# EasyEDA Pro project ProPrj_机器人系列_通用扩展模块.epro

# Schematic Schematic12
Board Name: 四合一底板; Create Date: 2025-06-17; Page Name: P1; Project Name: 机器人系列_通用扩展模块; Schematic Name: Schematic12; Update Date: 2025-07-04
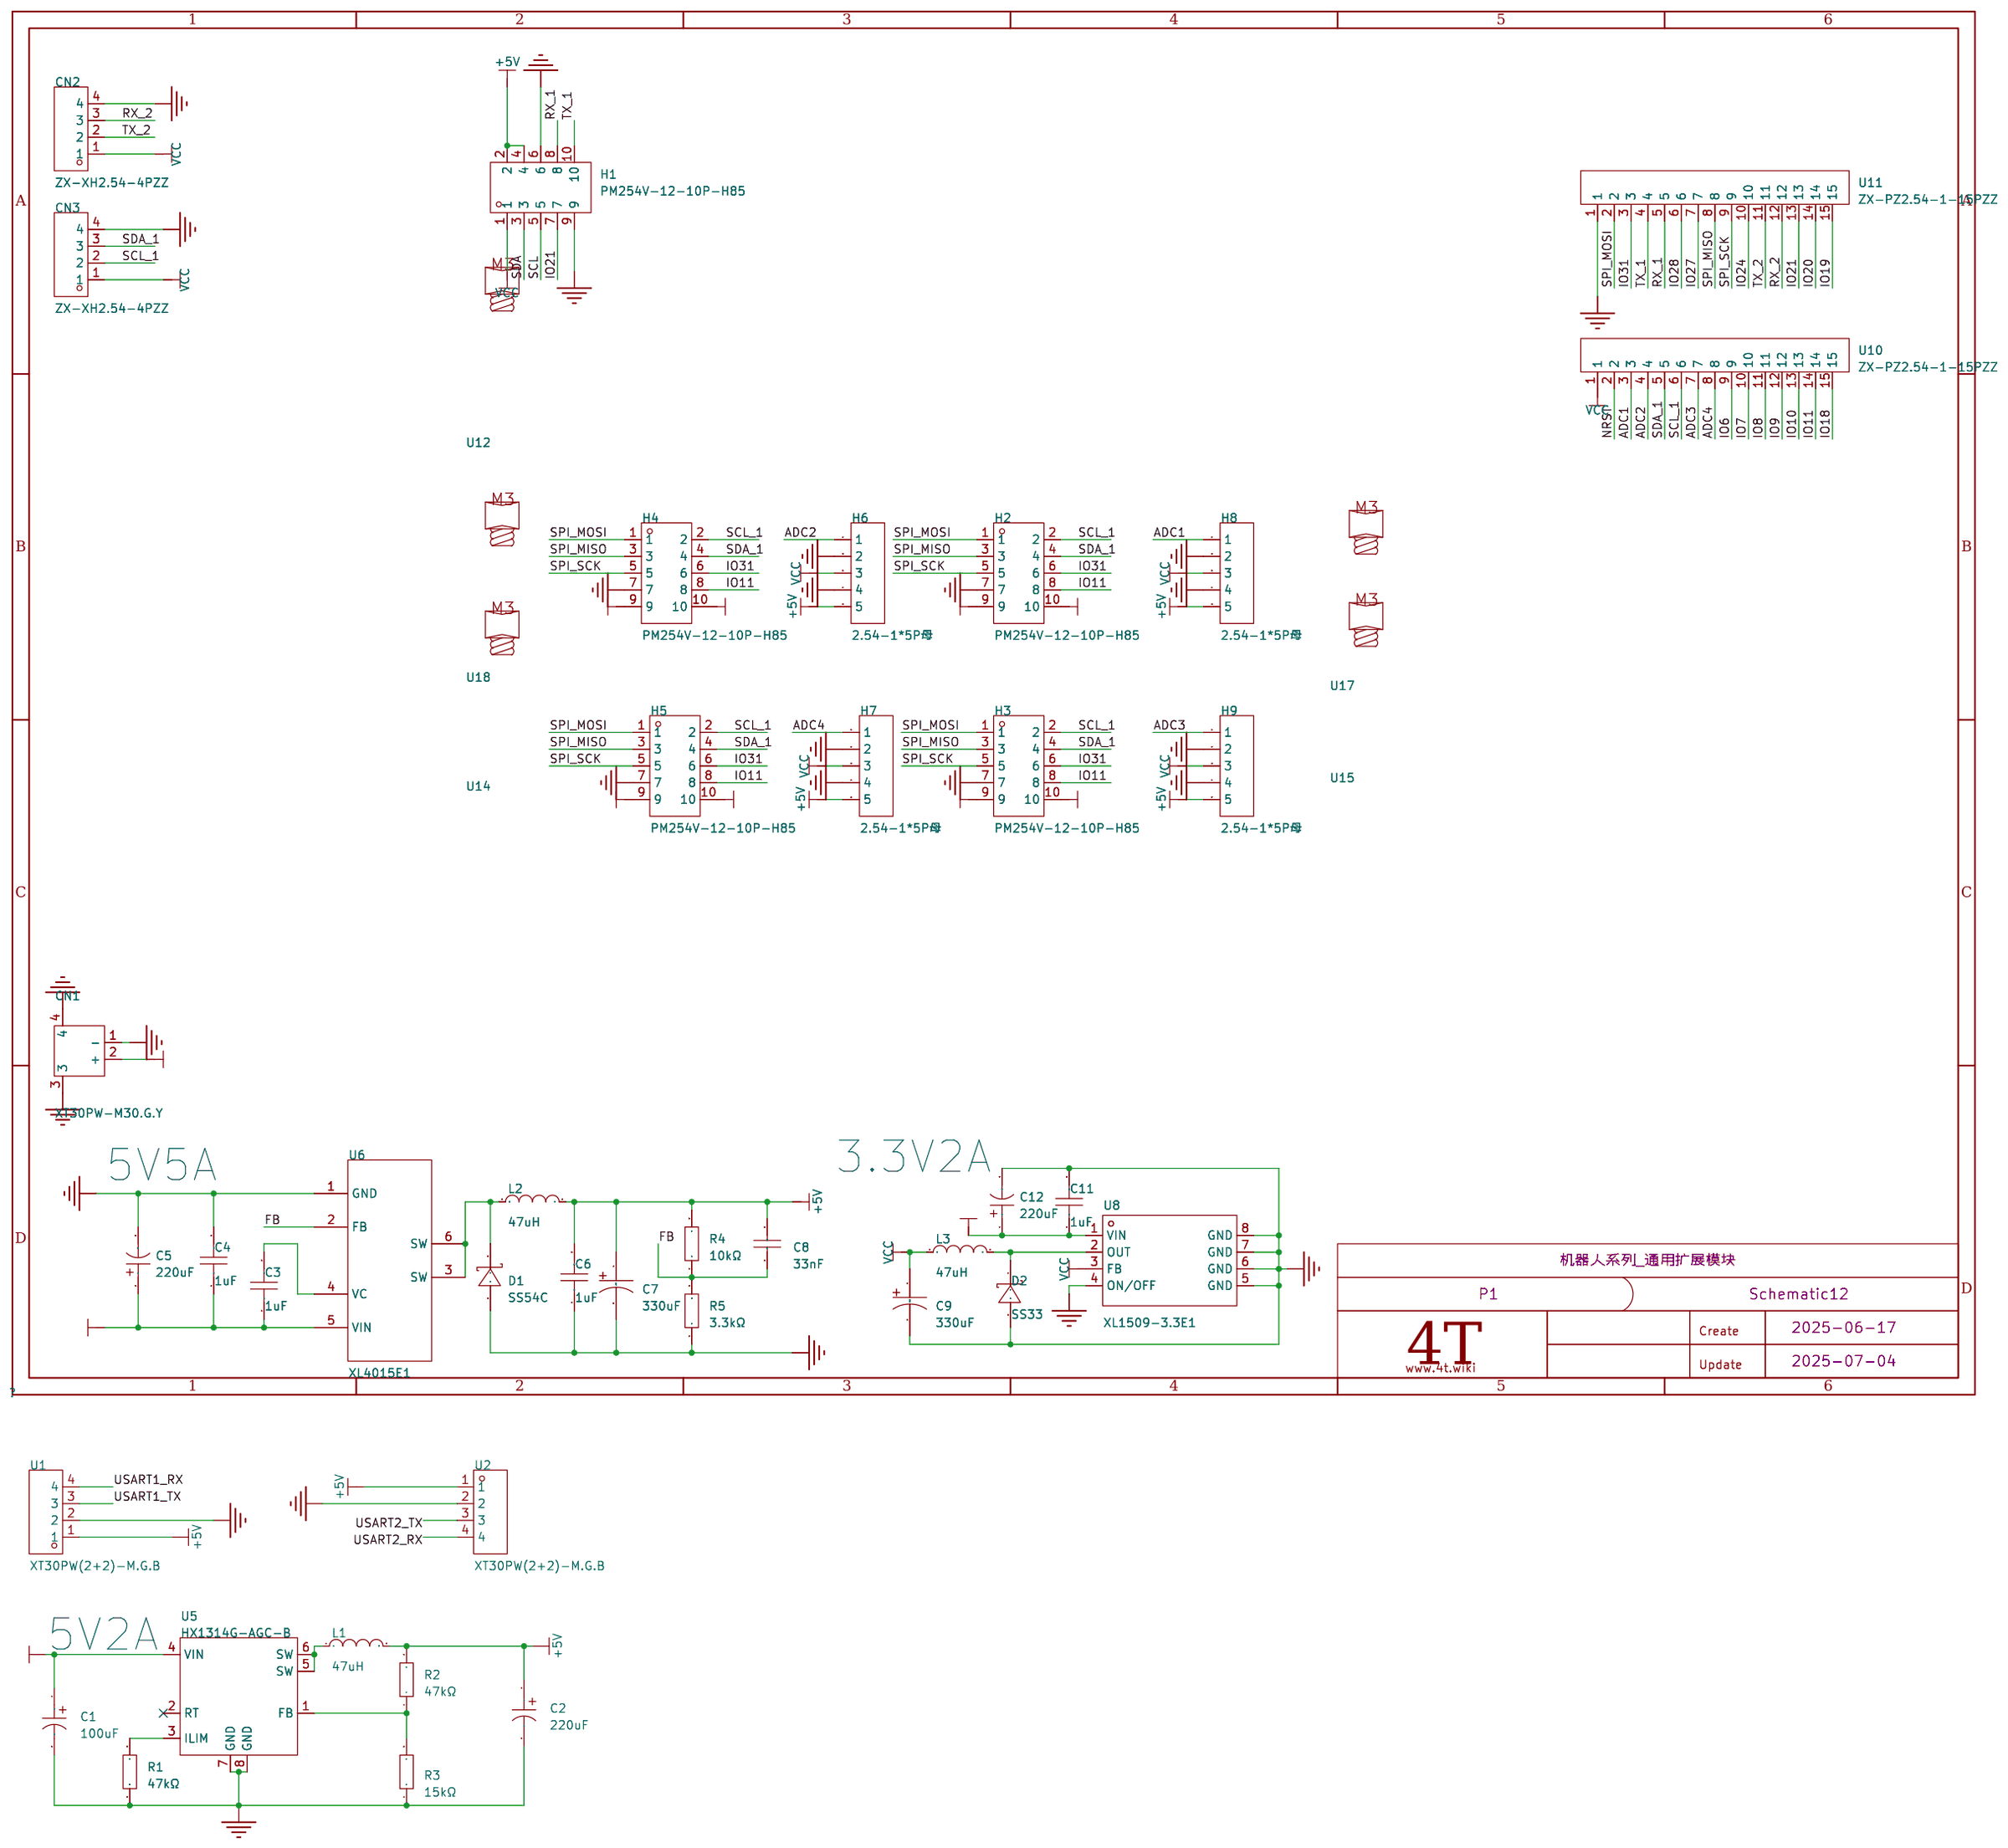
[diagram p0: schematic sheet]

## Parts
C1  100uF  [CAP-SMD_BD6.3-L6.6-W6.6-LS7.4-FD]  (no BOM)
C2  220uF  [CAP-SMD_BD6.3-L6.6-W6.6-FD]  (no BOM)
C3  1uF  [C0402]
C4  1uF  [C0402]
C5  220uF  [CAP-SMD_BD6.3-L6.6-W6.6-LS7.4-FD]
C6  1uF  [C0402]
C7  330uF  [CAP-SMD_BD8.0-L8.3-W8.3-LS9.3-FD-1]
C8  33nF  [C0603]
C9  330uF  [CAP-SMD_BD8.0-L8.3-W8.3-LS9.3-FD-1]
C11  1uF  [C0402]
C12  220uF  [CAP-SMD_BD6.3-L6.6-W6.6-LS7.4-FD]
CN1  XT30PW-M30.G.Y  [CONN-TH_XT30PW-M]
CN2  ZX-XH2.54-4PZZ  [CONN-TH_4P-P2.50_4PIN]
CN3  ZX-XH2.54-4PZZ  [CONN-TH_4P-P2.50_4PIN]
D1  SS54C  [SMC_L7.1-W6.2-LS8.1-R-RD]
D2  SS33  [SMA_L4.3-W2.6-LS5.1-RD]
H1  PM254V-12-10P-H85  [HDR-TH_10P-P2.54-V-F-R2-C5-S2.54]
H2  PM254V-12-10P-H85  [HDR-TH_10P-P2.54-V-F-R2-C5-S2.54]
H3  PM254V-12-10P-H85  [HDR-TH_10P-P2.54-V-F-R2-C5-S2.54]
H4  PM254V-12-10P-H85  [HDR-TH_10P-P2.54-V-F-R2-C5-S2.54]
H5  PM254V-12-10P-H85  [HDR-TH_10P-P2.54-V-F-R2-C5-S2.54]
H6  2.54-1*5P母  [HDR-TH_5P-P2.54-V-F]
H7  2.54-1*5P母  [HDR-TH_5P-P2.54-V-F]
H8  2.54-1*5P母  [HDR-TH_5P-P2.54-V-F]
H9  2.54-1*5P母  [HDR-TH_5P-P2.54-V-F]
L1  47uH  [IND-SMD_L7.3-W6.8]  (no BOM)
L2  47uH  [IND-SMD_L13.8-W12.6_H6.5]
L3  47uH  [IND-SMD_L7.3-W6.8]
R1  47kΩ  [R0603]  (no BOM)
R2  47kΩ  [R0603]  (no BOM)
R3  15kΩ  [R0603]  (no BOM)
R4  10kΩ  [R0603]
R5  3.3kΩ  [R0603]
U1  XT30PW(2+2)-M.G.B  [CONN-TH_4P-XT30PW-M]  (no BOM)
U2  XT30PW(2+2)-M.G.B  [CONN-TH_4P-XT30PW-M]  (no BOM)
U5  HX1314G-AGC-B  [SOP-8_L4.9-W3.9-P1.27-LS6.0-BL]  (no BOM)
U6  XL4015E1  [TO-263-5_L10.2-W8.9-P1.70-TL]
U8  XL1509-3.3E1  [SOP-8_L4.9-W3.9-P1.27-LS6.0-BL]
U10  ZX-PZ2.54-1-15PZZ  [HDR-TH_15P-P2.54-V-M]
U11  ZX-PZ2.54-1-15PZZ  [HDR-TH_15P-P2.54-V-M]
U12  -  [M3]
U14  -  [M3]
U15  -  [M3]
U17  -  [M3]
U18  -  [M3]

## Library data of the parts
C1 = RVT100UF35V67RV0034: 容值:100uF;精度:±20%;额定电压:35V;纹波电流:87mA@120kHz;等效串联电阻:-;; LCSC Part Name: 100uF ±20% 35V; Supplier Part: C2836442; Manufacturer: KNSCHA(科尼盛); Supplier Footprint: SMD,D6.3xL7.7mm; JLCPCB Part Class: 扩展库; Datasheet: https://atta.szlcsc.com/upload/public/pdf/source/20210528/C2836442_7F6389BF36F63F32D6DF3A507E8E95D6.pdf; Supplier: LCSC; Tolerance: ±20%; Rated Voltage: 35V; Ripple Current: 87mA@120kHz; φD: 6.3mm; L: 7.7mm; Lifetime @ Temp: 2000hrs@105℃; Operating Temperature: -55℃~+105℃
C2 = RVT220UF16V67RV0015: 容值:220uF;精度:±20%;额定电压:16V;纹波电流:110mA@120Hz;等效串联电阻:-;; LCSC Part Name: 220uF ±20% 16V; Supplier Part: C2887273; Manufacturer: KNSCHA(科尼盛); Supplier Footprint: SMD,D6.3xL7.7mm; JLCPCB Part Class: 扩展库; Datasheet: https://atta.szlcsc.com/upload/public/pdf/source/20210824/3DC9999D9B098FE241E3A26137981C4C.pdf; Supplier: LCSC; Tolerance: ±20%; Rated Voltage: 16V; Ripple Current: 110mA@120Hz; φD: 6.3mm; L: 7.7mm; Lifetime @ Temp: 2000hrs@105℃; Operating Temperature: -55℃~+105℃
C3 C4 C6 C11 = CL05A105KA5NQNC: 容值:1uF;精度:±10%;额定电压:25V;材质(温度系数):X5R;; LCSC Part Name: 1uF ±10% 25V; Supplier Part: C52923; Manufacturer: SAMSUNG(三星); Supplier Footprint: 0402; JLCPCB Part Class: 基础库; Datasheet: https://atta.szlcsc.com/upload/public/pdf/source/20160218/1457707763339.pdf; Supplier: LCSC; Tolerance: ±10%; Voltage Rated: 25V; Temperature Coefficient: X5R
C5 C12 = RVT1E221M0607: 容值:220uF;精度:±20%;额定电压:25V;纹波电流:150mA@120Hz;等效串联电阻(ESR):-;; LCSC Part Name: 220uF ±20% 25V; Supplier Part: C2918361; Manufacturer: ROQANG(容强); Supplier Footprint: SMD,D6.3xL7.7mm; JLCPCB Part Class: 扩展库; Datasheet: https://atta.szlcsc.com/upload/public/pdf/source/20241024/87413EF5140CF44BEEEC408A2EAB4036.pdf; Supplier: LCSC; Tolerance: ±20%; Voltage Rating: 25V; Ripple Current: 150mA@120Hz; Diameter: 6.3mm; Height - Seated (Max): 7.7mm; Lifetime: 2000hrs@105℃; Operating Temperature: -40℃~+105℃
C7 C9 = RVT1E331M0810_C335985: 容值:330uF;精度:±20%;额定电压:25V;纹波电流:228mA@120Hz;等效串联电阻(ESR):-;; LCSC Part Name: 330uF ±20% 25V; Supplier Part: C335985; Manufacturer: ROQANG(容强); Manufacturer Part: RVT1E331M0810; Supplier Footprint: SMD,D8xL10.2mm; JLCPCB Part Class: Extended Part; Datasheet: https://atta.szlcsc.com/upload/public/pdf/source/20181128/C335987_23CA7AA50FB42690DF736C43FE112376.pdf; Supplier: LCSC; Tolerance: ±20%; Voltage Rating: 25V; Ripple Current: 228mA@120Hz; Diameter: 8mm; Height - Seated (Max): 10.2mm; Lifetime: 2000hrs@105℃; Operating Temperature: -40℃~+105℃
C8 = CL10B333KB8NNNC: 容值:33nF;精度:±10%;额定电压:50V;材质(温度系数):X7R;; LCSC Part Name: 33nF ±10% 50V; Supplier Part: C21117; Manufacturer: SAMSUNG(三星); Supplier Footprint: 0603; JLCPCB Part Class: 基础库; Datasheet: https://atta.szlcsc.com/upload/public/pdf/source/20160218/1457707763339.pdf; Supplier: LCSC; Tolerance: ±10%; Voltage Rated: 50V; Temperature Coefficient: X7R
CN1 = XT30PW-M30.G.Y: 类别:-;类型1:-;; LCSC Part Name: AMASS(艾迈斯)航模插头 卧式弯脚 XT30PW-M公头; Supplier Part: C431092; Manufacturer: AMASS(艾迈斯); JLCPCB Part Class: 扩展库; Datasheet: https://atta.szlcsc.com/upload/public/pdf/source/20220222/6A9F22F7850E25B33E1BE430ADF8560B.pdf; Supplier: LCSC; Type: 航模插头; RatedVoltage: DC 500V; InterfaceType: 公头; RatedCurrent: 15A; RecommendedWireGauge: 16/18/20AWG; contact resistance: 1.2mΩ; specifications: 2pin
CN2 CN3 = ZX-XH2.54-4PZZ: 插针结构:1x4P;间距:2.5mm;安装方式:直插;参考系列:XH;总PIN数:4P;排数:1;每排PIN数:4;行距:-;额定电流:3A;触头材质:黄铜;触头镀层:锡;工作温度范围:-25℃~+85℃;; LCSC Part Name: 1x4P 间距:2.5mm 直插 系列:XH; Supplier Part: C7429634; Manufacturer: Megastar(兆星); Supplier Footprint: 插件,P=2.5mm; JLCPCB Part Class: 扩展库; Datasheet: https://atta.szlcsc.com/upload/public/pdf/source/20230619/B529A2163E0159A644AB3383D208FB03.pdf; Supplier: LCSC; Pins Structure: 1x4P; Pitch: 2.5mm; Mounting Type: 直插; Reference Series: XH; Number of Pins: 4P; Number of Rows: 1; Number of PINs Per Row: 4; Rated Current: 3A; Contact Material: 黄铜; Contact Plating: 锡; Operating Temperature: -25℃~+85℃; Rated Voltage (Max): 250V; Plastic Material: PA66; Flame Retardant Rating: UL94V-0; Color: 白色; Z-Height of the Board: 7mm; X-Length of Bottom Edge on Board (Spacing Line): 12.5mm; Y-Width of Bottom Edge on Board: 5.9mm
D1 = SS54C_C16103: 二极管配置:独立式;正向压降(Vf):550mV@5A;直流反向耐压(Vr):40V;整流电流:5A;; LCSC Part Name: 电压:40V 电流:5A; Supplier Part: C16103; Manufacturer: MDD(辰达半导体); Supplier Footprint: SMC(DO-214AB); JLCPCB Part Class: 扩展库; Datasheet: https://atta.szlcsc.com/upload/public/pdf/source/20240809/85001FE6B8209D29868878B4C087FFCD.pdf; Supplier: LCSC; Diode Configuration: 独立式; Forward Voltage (Vf@If): 550mV@5A; Reverse Voltage (Vr): 40V; Rectified Current: 5A; Reverse Leakage Current (Ir): 1mA@40V
D2 = SS33_C28646294: 二极管配置:独立式;正向压降(Vf):550mV@3A;直流反向耐压(Vr):30V;整流电流:3A;; LCSC Part Name: 电压:30V 电流:3A; Supplier Part: C28646294; Manufacturer: 宏嘉诚; Supplier Footprint: SMA; JLCPCB Part Class: 扩展库; Datasheet: https://atta.szlcsc.com/upload/public/pdf/source/20250121/BC4995F7852DEFC8D1A54697BDB410C2.pdf; Supplier: LCSC; Diode Configuration: 独立式; Voltage - Forward(Vf@If): 550mV@3A; Voltage - DC Reverse(Vr): 30V; Current - Rectified: 3A; Reverse Leakage Current (Ir): 200uA@30V
H1-H5 = PM254V-12-10P-H85: 插孔结构:2x5P;间距:2.54mm;行距:2.54mm;安装类型:直插;排数:双排;总孔位数:10P;塑高:-;触头材质:黄铜;触头镀层:-;; LCSC Part Name: 间距:2.54mm 2x5P 直插; Supplier Part: C492399; Manufacturer: XFCN(兴飞); Supplier Footprint: 插件,P=2.54mm; JLCPCB Part Class: 扩展库; Datasheet: https://atta.szlcsc.com/upload/public/pdf/source/20200309/C492399_8C441E2934FBB604A89B37A68AA45ECF.pdf; Supplier: LCSC; Holes Structure: 2x5P; Pitch: 2.54mm; Row Spacing: 2.54mm; Mounting Type: 直插; Number of Rows: 双排; Number of Holes: 10P; Contact Material: 黄铜
H6-H9 = 2.54-1*5P母: 插孔结构:1x5P;间距:2.54mm;行距:-;安装类型:直插;排数:单排;总孔位数:5P;塑高:-;触头材质:-;触头镀层:-;; LCSC Part Name: 间距:2.54mm 1x5P 直插; Supplier Part: C50950; Manufacturer: BOOMELE(博穆精密); Supplier Footprint: 插件,P=2.54mm; JLCPCB Part Class: 扩展库; Datasheet: https://atta.szlcsc.com/upload/public/pdf/source/20210301/C2718488_F4427B881E42CAA8DDB0B1C12B3A522C.pdf; Supplier: LCSC; Holes Structure: 1x5P; Pitch: 2.54mm; Mounting Type: 直插; Number of Rows: 单排; Number of Holes: 5P
L1 L3 = FXL0650-470-M: 电感值:47uH;精度:±20%;额定电流:2A;饱和电流(Isat):2.6A;类型:一体成型电感;; LCSC Part Name: 47uH ±20% 2.6A; Supplier Part: C475527; Manufacturer: cjiang(长江微电); Supplier Footprint: SMD,6.6x7mm; JLCPCB Part Class: 扩展库; Datasheet: https://atta.szlcsc.com/upload/public/pdf/source/20240426/3189EA8206330E2108542F9E34E540E7.pdf; Supplier: LCSC; Tolerance: ±20%; Rated Current: 2A; Saturation Current (Isat): 2.6A; DC Resistance (DCR): 230mΩ; Type: 一体成型电感
L2 = YSPI1365-470M: 电感值:47uH;精度:±20%;额定电流:5A;类型:一体成型电感;; LCSC Part Name: 47uH ±20%; Supplier Part: C497913; Manufacturer: YJYCOIN(益嘉源); Supplier Footprint: SMD,13.8x12.6x6.5mm; JLCPCB Part Class: 扩展库; Datasheet: https://atta.szlcsc.com/upload/public/pdf/source/20230801/AED9D02F50D39DFEE57BC1CE3E1D3DA7.pdf; Supplier: LCSC; Tolerance: ±20%; Current Rating: 5A; DC Resistance(DCR): 57.5mΩ; Type: 一体成型电感
R1 R2 = 0603WAF4702T5E: 电阻类型:厚膜电阻;阻值:47kΩ;精度:±1%;功率:100mW;最大工作电压:75V;温度系数:±100ppm/℃;; LCSC Part Name: 47kΩ ±1% 100mW 厚膜电阻; Supplier Part: C25819; Manufacturer: UNI-ROYAL(厚声); Supplier Footprint: 0603; JLCPCB Part Class: 基础库; Datasheet: https://atta.szlcsc.com/upload/public/pdf/source/20200306/C422600_1E6D84923E4A46A82E41ADD87F860B5C.pdf; Supplier: LCSC; Type: 厚膜电阻; Tolerance: ±1%; Power(Watts): 100mW; Overload Voltage (Max): 75V; Temperature Coefficient: ±100ppm/℃; Operating Temperature Range: -55℃~+155℃
R3 = 0603WAF1502T5E: 电阻类型:厚膜电阻;阻值:15kΩ;精度:±1%;功率:100mW;最大工作电压:75V;温度系数:±100ppm/℃;; LCSC Part Name: 15kΩ ±1% 100mW 厚膜电阻; Supplier Part: C22809; Manufacturer: UNI-ROYAL(厚声); Supplier Footprint: 0603; JLCPCB Part Class: 基础库; Datasheet: https://atta.szlcsc.com/upload/public/pdf/source/20200306/C422600_1E6D84923E4A46A82E41ADD87F860B5C.pdf; Supplier: LCSC; Type: 厚膜电阻; Tolerance: ±1%; Power(Watts): 100mW; Overload Voltage (Max): 75V; Temperature Coefficient: ±100ppm/℃; Operating Temperature Range: -55℃~+155℃
R4 = RM06JTN103: 电阻类型:厚膜电阻;阻值:10kΩ;精度:±5%;功率:100mW;最大工作电压:75V;温度系数:±200ppm/℃;; LCSC Part Name: 厚膜电阻 10kΩ ±5% 100mW; Supplier Part: C112924; Manufacturer: 大毅科技; Supplier Footprint: 0603; JLCPCB Part Class: 扩展库; Datasheet: https://atta.szlcsc.com/upload/public/pdf/source/20180912/C193177_4BB6657F58E460C8C6C7C234EECF646B.pdf; Supplier: LCSC; Type: 厚膜电阻; Tolerance: ±5%; Power(Watts): 100mW; Overload Voltage (Max): 75V; Temperature Coefficient: ±200ppm/℃; Operating Temperature Range: -55℃~+155℃
R5 = 0603WAF3301T5E: 电阻类型:厚膜电阻;阻值:3.3kΩ;精度:±1%;功率:100mW;最大工作电压:75V;温度系数:±100ppm/℃;; LCSC Part Name: 3.3kΩ ±1% 100mW 厚膜电阻; Supplier Part: C22978; Manufacturer: UNI-ROYAL(厚声); Supplier Footprint: 0603; JLCPCB Part Class: 基础库; Datasheet: https://atta.szlcsc.com/upload/public/pdf/source/20200306/C422600_1E6D84923E4A46A82E41ADD87F860B5C.pdf; Supplier: LCSC; Type: 厚膜电阻; Tolerance: ±1%; Power(Watts): 100mW; Overload Voltage (Max): 75V; Temperature Coefficient: ±100ppm/℃; Operating Temperature Range: -55℃~+155℃
U1 U2 = XT30PW(2+2)-M.G.B: LCSC Part Name: XT30PW(2+2)功率数据混合插头公金黑PCB弯插; Supplier Part: C19268030; Manufacturer: AMASS(艾迈斯); JLCPCB Part Class: 扩展库; Datasheet: https://atta.szlcsc.com/upload/public/pdf/source/20240112/A815AE62CB016131F8636555ECBDABF7.pdf; Supplier: LCSC
U5 = HX1314G-AGC-B: Supplier Part: C42413374; Manufacturer: HEXIN(禾芯微); Supplier Footprint: SOP-8L; JLCPCB Part Class: 扩展库; Datasheet: https://atta.szlcsc.com/upload/public/pdf/source/20241213/BD76426362184173AF53615439360D89.pdf; Supplier: LCSC
U6 = XL4015E1: 功能类型:降压型;输出类型:可调;工作电压:8V~36V;输出电压:1.25V~32V;输出电流:5A;; LCSC Part Name: 5A 180KHz 36V 降压型DC-DC转换器; Supplier Part: C51661; Manufacturer: XLSEMI(芯龙); Supplier Footprint: TO-263-5; JLCPCB Part Class: 扩展库; Datasheet: https://atta.szlcsc.com/upload/public/pdf/source/20250109/4BED35EECA130A9C007A6498C0DD05D8.pdf; Supplier: LCSC; Function: 降压型; Output Type: 可调; Voltage - Supply: 8V~36V; Output Voltage: 1.25V~32V; Output Current: 5A; Frequency - Switching: 180kHz; Operating Temperature: -40℃~+125℃; Synchronous Rectifier: 是; Number of Outputs: 1; Topology: 降压式; Quiescent Current: 5mA; Switch tube (built-in/external): 内置
U8 = XL1509-3.3E1: 功能类型:降压型;工作电压:4.5V~40V;输出电流:2A;; Supplier Part: C74193; Manufacturer: XLSEMI(芯龙); Supplier Footprint: SOP-8; JLCPCB Part Class: 扩展库; Datasheet: https://atta.szlcsc.com/upload/public/pdf/source/20160525/1464169836595.pdf; Supplier: LCSC; Function: 降压型; Input Voltage: 4.5V~40V; Output Current: 2A; Switching Frequency: 150kHz; Operating Temperature: -40℃~+125℃; Number of Outputs: 1; Topology: 降压式; Switch tube (built-in/external): 内置
U10 U11 = ZX-PZ2.54-1-15PZZ: 插针结构:1x15P;间距:2.54mm;行距:-;圆针/方针:方针;安装方式:直插;排数:单排;总PIN位数:15P;额定电流:3A;额定电压:1kV;配合针长度:6mm;塑高:2.5mm;端接针长度:3mm;触头材质:黄铜;触头镀层:金;工作温度:-40℃~+105℃;颜色:黑色;; LCSC Part Name: 1x15P 间距:2.54mm 方针 直插; Supplier Part: C7501269; Manufacturer: Megastar(兆星); Supplier Footprint: 插件,P=2.54mm; JLCPCB Part Class: 扩展库; Datasheet: https://atta.szlcsc.com/upload/public/pdf/source/20231122/A1A587BCB61FD4E661A7B23F28C6B7B8.pdf; Supplier: LCSC; Pin Structure: 1x15P; Pitch: 2.54mm; Circluar Pins/Square Pins: 方针; Mounting Type: 直插; Number of Rows: 单排; Number of Pins: 15P; Current Rating: 3A; Voltage Rating (Max): 1kV; Length of Mating Pin: 6mm; Insulation Height: 2.5mm; Length of End Connection Pin: 3mm; Contact Material: 黄铜; Contact Plating: 金; Operating Temperature: -40℃~+105℃; Color: 黑色
U12 U14 U15 U17 U18 = M3安装孔

## Nets
+5V: C2.1 C6.2 C7.1 C8.2 H1.2 H1.4 H6.5 H7.5 H8.5 H9.5 L1.2 L2.2 R2.2 R4.2 U1.1 U2.1
GND: C1.2 C2.2 C4.2 C5.2 C6.1 C7.2 C9.2 C11.2 C12.2 CN1.1(-) CN1.3 CN1.4 CN2.4 CN3.4 D1.1(A) D2.2(A) H1.6 H1.9 H2.7 H3.7 H4.7 H5.7 H6.2 H6.4 H7.2 H7.4 H8.2 H8.4 H9.2 H9.4 R1.1 R3.1 R5.1 U1.2 U2.2 U5.7(GND) U5.8(GND) U6.1(GND) U8.4(ON/OFF) U8.5(GND) U8.6(GND) U8.7(GND) U8.8(GND) U11.1
VCC: C9.1 CN2.1 CN3.1 H1.1 H6.3 H7.3 H8.3 H9.3 L3.1 U8.3(FB) U10.1
ADC1: H8.1 U10.3
ADC2: H6.1 U10.4
ADC3: H9.1 U10.7
ADC4: H7.1 U10.8
BAT+: C1.1 C3.1 C4.1 C5.1 C11.1 C12.1 CN1.2(+) H2.9 H2.10 H3.9 H3.10 H4.9 H4.10 H5.9 H5.10 U5.4(VIN) U6.5(VIN) U8.1(VIN)
FB: C8.1 R4.1 R5.2 U6.2(FB)
IO6: U10.9
IO7: U10.10
IO8: U10.11
IO9: U10.12
IO10: U10.13
IO11: H2.8 H3.8 H4.8 H5.8 U10.14
IO18: U10.15
IO19: U11.15
IO20: U11.14
IO21: H1.7 U11.13
IO24: U11.10
IO27: U11.7
IO28: U11.6
IO31: H2.6 H3.6 H4.6 H5.6 U11.3
NRST: U10.2
RX_1: H1.8 U11.5
RX_2: CN2.3 U11.12
SCL: H1.5
SCL_1: CN3.2 H2.2 H3.2 H4.2 H5.2 U10.6
SDA: H1.3
SDA_1: CN3.3 H2.4 H3.4 H4.4 H5.4 U10.5
SPI_MISO: H2.3 H3.3 H4.3 H5.3 U11.8
SPI_MOSI: H2.1 H3.1 H4.1 H5.1 U11.2
SPI_SCK: H2.5 H3.5 H4.5 H5.5 U11.9
TX_1: H1.10 U11.4
TX_2: CN2.2 U11.11
USART1_RX: U1.4
USART1_TX: U1.3
USART2_RX: U2.4
USART2_TX: U2.3
$1N6875: C3.2 U6.4(VC)
$1N7231: D1.2(K) L2.1 U6.3(SW) U6.6(SW)
$1N9423: D2.1(K) L3.2 U8.2(OUT)
Net-(L1-1): L1.1 U5.5(SW) U5.6(SW)
Net-(R1-2): R1.2 U5.3(ILIM)
Net-(R2-1): R2.1 R3.2 U5.1(FB)

Not connected (* = marked no-connect by the designer): U5 2(RT)*

## Notes on the sheet
- 5V5A
- 3.3V2A
- 5V2A
